# Altium schematic sheet TL203蓝牙主板20529.SchDoc
size A2; PageSetup: Record=PageOptions|CenterHorizontal=True|CenterVertical=True|PrintScale=0.52|XCorrection=1.00|YCorrection=1.00|PrintKind=0|BorderSize=5000000|LeftOffset=0|BottomOffset=0|Orientation=2|PaperLength=1000|PaperWidth=1000|Scale=100|PaperSource=7|PrintQuality=-4|MediaType=1|DitherType=10|PaperKind=A4|PrintScaleMode=1
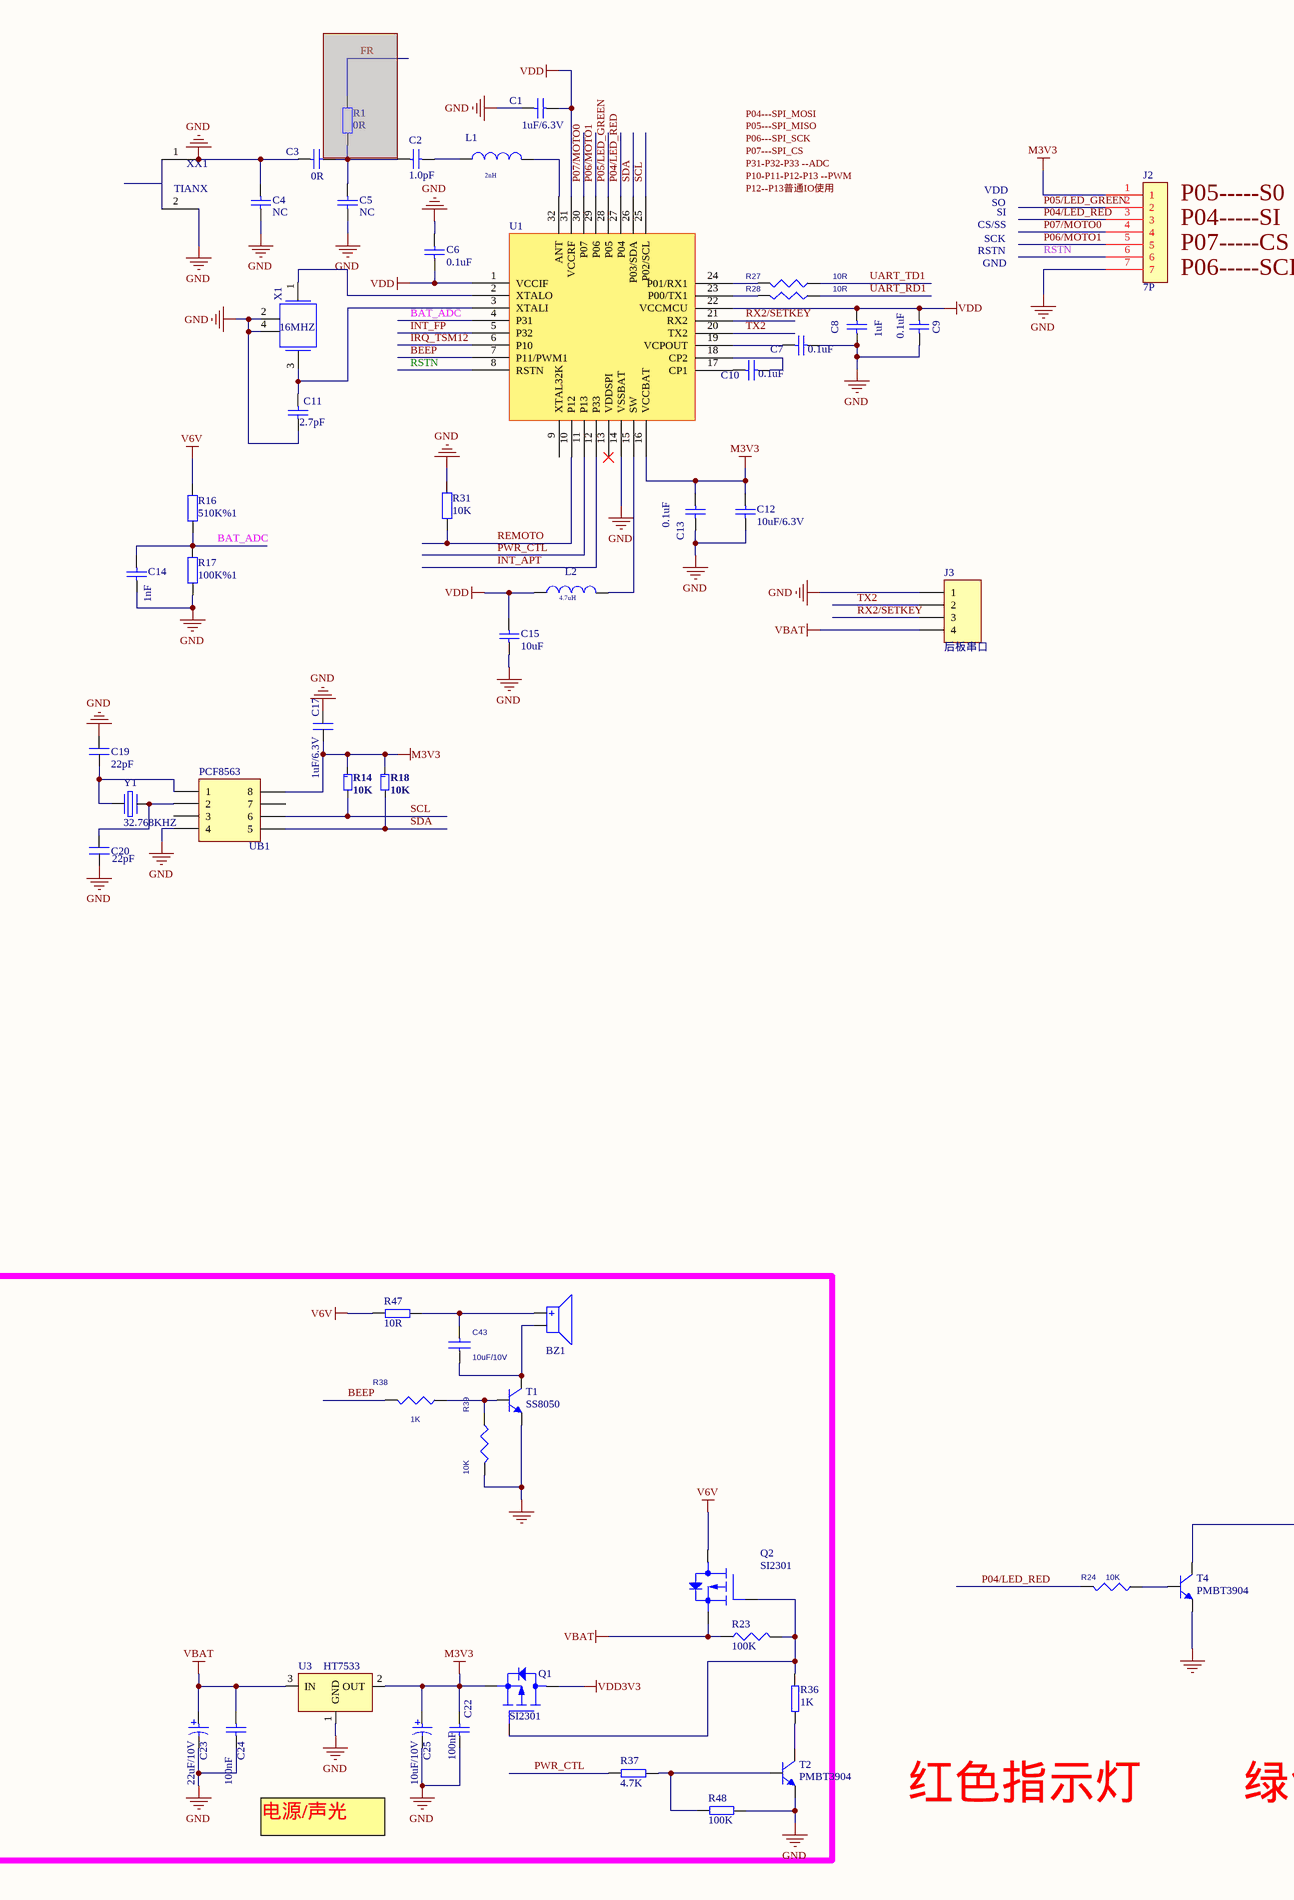
[diagram p0: TL203蓝牙主板20529.SchDoc, left]
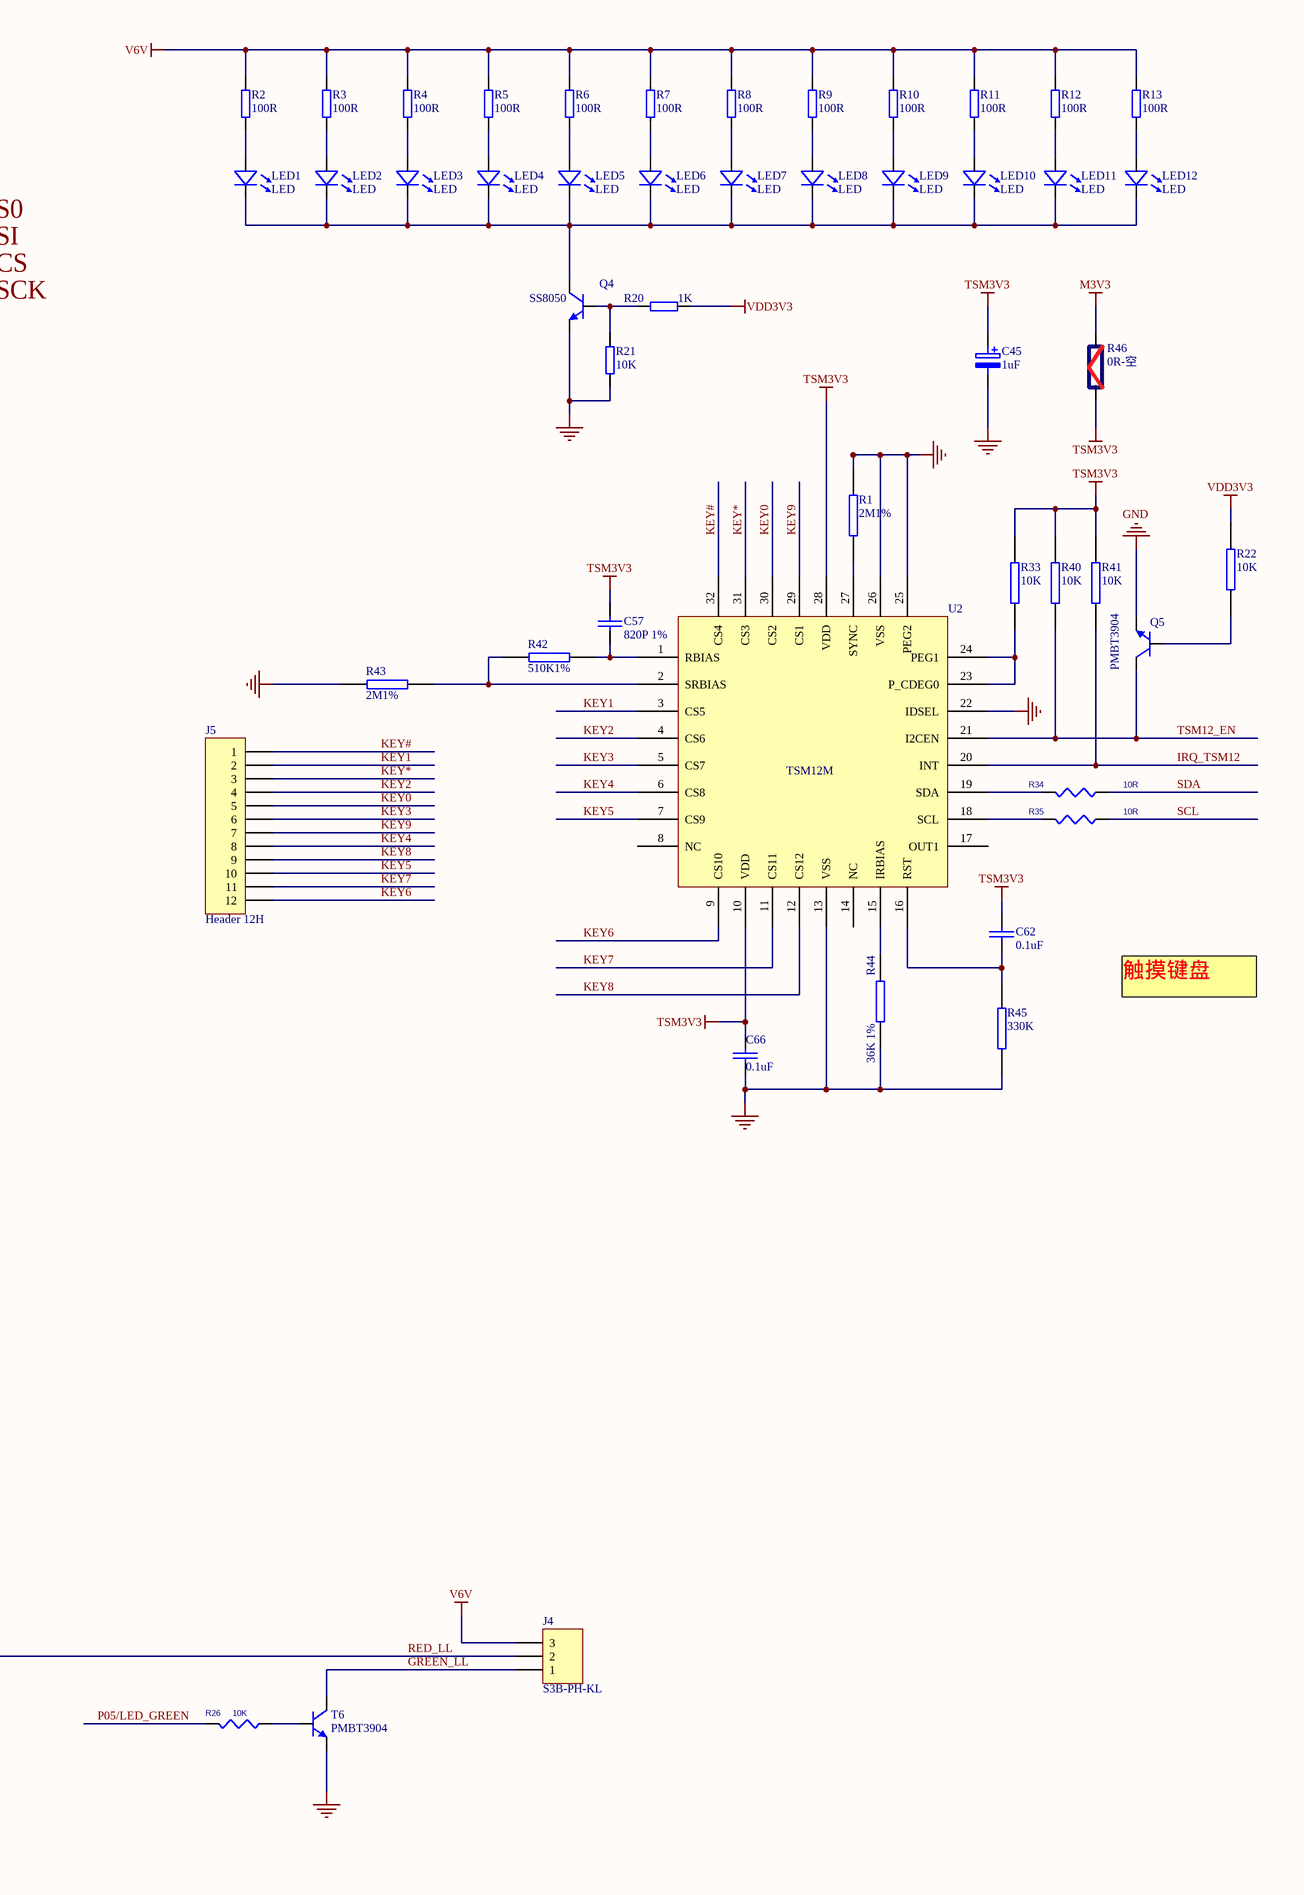
[diagram p1: TL203蓝牙主板20529.SchDoc, right]

## Parts
(Parts that share a designator on the sheet are numbered #1, #2 ... from top to bottom, then left to right.)
BZ1  BUZZER  [BUZZER_D93_L40]  (value not drawn)
C1  1uF/6.3V  [LC-0402_C]
C2  1.0pF  [LC-0402_C]
C3  0R  [LC-0402_C]
C4  NC  [LC-0402_C]
C5  NC  [LC-0402_C]
C6  0.1uF  [LC-0402_C]
C7  0.1uF  [LC-0402_C]
C8  1uF  [LC-0402_C]
C9  0.1uF  [LC-0402_C]
C10  0.1uF  [LC-0402_C]
C11  2.7pF  [LC-0402_C]
C12  10uF/6.3V  [LC-0603_C]
C13  0.1uF  [LC-0402_C]
C14  1nF  [LC-0402_C]
C15  10uF  [LC-0402_C]
C17  1uF/6.3V  [LC-0603_C]
C19  22pF  [LC-0603_C]
C20  22pF  [LC-0603_C]
C22  100nF  [LC-0603_C]
C23  22uF/10V  [LC-0805_C]
C24  100nF  [LC-0603_C]
C25  10uF/10V  [LC-0805_C]
C43  10uF/10V  [LC-0603_C]
C45  1uF  [LC-0603_C]
C57  820P 1%  [LC-0402_C]
C62  0.1uF  [LC-0402_C]
C66  0.1uF  [LC-0402_C]
J2  7P  [7P-2.0MM]
J3  后板串口  [4P-2.0XX]
J4  S3B-PH-KL  [3P-1.25mm-SMT]
J5  Header 12H  [6P*2*1.27MM_1]
L1  2nH  [LC-0402_L]
L2  4.7uH  [LC-0603_L]
LED1  LED  [0603LED]
LED2  LED  [0603LED]
LED3  LED  [0603LED]
LED4  LED  [0603LED]
LED5  LED  [0603LED]
LED6  LED  [0603LED]
LED7  LED  [0603LED]
LED8  LED  [0603LED]
LED9  LED  [0603LED]
LED10  LED  [0603LED]
LED11  LED  [0603LED]
LED12  LED  [0603LED]
Q1  SI2301  [SOT-23 - GDS]
Q2  SI2301  [SOT-23 - GDS]
Q4  SS8050  [SOT-23-3L]
Q5  PMBT3904  [SOT-23-3L]
R1#1  0R  [LC-0603_R]  (masked out: inside a compile mask, not in the netlist)
R1#2  2M1%  [LC-0402_R]
R2  100R  [LC-0603_R]
R3  100R  [LC-0603_R]
R4  100R  [LC-0603_R]
R5  100R  [LC-0603_R]
R6  100R  [LC-0603_R]
R7  100R  [LC-0603_R]
R8  100R  [LC-0603_R]
R9  100R  [LC-0603_R]
R10  100R  [LC-0603_R]
R11  100R  [LC-0603_R]
R12  100R  [LC-0603_R]
R13  100R  [LC-0603_R]
R14  10K  [LC-0603_R]
R16  510K%1  [LC-0402_R]
R17  100K%1  [LC-0402_R]
R18  10K  [LC-0603_R]
R20  1K  [LC-0603_R]
R21  10K  [LC-0603_R]
R22  10K  [LC-0603_R]
R23  100K  [LC-0603_R]
R24  10K  [LC-0603_R]
R26  10K  [LC-0603_R]
R27  10R  [LC-0402_R]
R28  10R  [LC-0402_R]
R31  10K  [LC-0402_R]
R33  10K  [LC-0402_R]
R34  10R  [LC-0402_R]
R35  10R  [LC-0402_R]
R36  1K  [LC-0603_R]
R37  4.7K  [LC-0603_R]
R38  1K  [LC-0603_R]
R39  10K  [LC-0603_R]
R40  10K  [LC-0402_R]
R41  10K  [LC-0402_R]
R42  510K1%  [LC-0402_R]
R43  2M1%  [LC-0402_R]
R44  36K 1%  [LC-0402_R]
R45  330K  [LC-0402_R]
R46  0R-空  [LC-0603_R]
R47  10R  [LC-0603_R]
R48  100K  [LC-0603_R]
T1  SS8050  [SOT-23-3L]
T2  PMBT3904  [SOT-23-3L]
T4  PMBT3904  [SOT-23-3L]
T6  PMBT3904  [SOT-23-3L]
U1  BK3431Q  [QFN32_4*4*0.4]  (value not drawn)
U2  TSM12M  [ADS_TMS12]
U3  HT7533  [SOT-23-3L]
UB1  PCF8563  [SOP8]
X1  16MHZ  [XTAL3225]
XX1  TIANX  [BT_NAMI_1]
Y1  32.768KHZ  [晶振-9]

## Nets
GND: C1.1 C3.1 C4.1 C4.2 C5.1 C6.1 C7.2 C8.1 C9.1 C11.1 C12.2 C13.2 C14.1 C15.1 C17.2 C19.2 C20.1 C22.2 C23.2 C24.2 C25.2 C45.2 C66.1 J2.7 J3.1 Q4.2 Q5.2 R1#2.2 R17.2 R21.1 R31.1 R39.2 R43.1 R44.1 R45.1 R48.1 T1.2 T2.2 T4.2 T6.2 U1.14(VSSBAT) U2.13(VSS) U2.22(IDSEL) U2.25(PEG2) U2.26(VSS) U3.1(GND) UB1.4 X1.2 X1.4 XX1.1 XX1.2
M3V3: C12.1 C13.1 C17.1 C22.1 C25.1 J2.1 Q1.S(SOURCE) R14.1 R18.1 R46.2 U1.16(VCCBAT) U3.2(OUT) UB1.8
TSM3V3: C45.1 C57.2 C62.2 C66.2 R33.2 R40.2 R41.2 R46.1 U2.10(VDD) U2.28(VDD)
V6V: J4.3 Q2.D(DRAIN) R2.2 R3.2 R4.2 R5.2 R6.2 R7.2 R8.2 R9.2 R10.2 R11.2 R12.2 R13.2 R16.1 R47.2
VBAT: C23.1 C24.1 J3.4 Q2.S(SOURCE) R23.1 U3.3(IN)
VDD: C1.2 C6.2 C8.2 C9.2 C15.2 L2.1(P1) U1.1(VCCIF) U1.22(VCCMCU) U1.31(VCCRF)
VDD3V3: Q1.D(DRAIN) R20.2 R22.2
BAT_ADC: C14.2 R16.2 R17.1 U1.4(P31)
BEEP: R38.2 U1.7(P11/PWM1)
GREEN_LL: J4.1 T6.3
INT_APT: U1.12(P33)
INT_FP: U1.5(P32)
IRQ_TSM12: R41.1 U1.6(P10) U2.20(INT)
KEY0: J5.5 U2.30(CS2)
KEY1: J5.2 U2.3(CS5)
KEY2: J5.4 U2.4(CS6)
KEY3: J5.6 U2.5(CS7)
KEY4: J5.8 U2.6(CS8)
KEY5: J5.10 U2.7(CS9)
KEY6: J5.12 U2.9(CS10)
KEY7: J5.11 U2.11(CS11)
KEY8: J5.9 U2.12(CS12)
KEY9: J5.7 U2.29(CS1)
KEY#: J5.1 U2.32(CS4)
KEY*: J5.3 U2.31(CS3)
P04/LED_RED: J2.3 R24.2 U1.27(P04)
P05/LED_GREEN: J2.2 R26.2 U1.28(P05)
P06/MOTO1: J2.5 U1.29(P06)
P07/MOTO0: J2.4 U1.30(P07)
PWR_CTL: R37.1 U1.11(P13)
RED_LL: J4.2 T4.3
REMOTO: R31.2 U1.10(P12)
RSTN: J2.6 U1.8(RSTN)
RX2/SETKEY: J3.3 U1.21(RX2)
SCL: R14.2 R35.1 U1.25(P02/SCL) UB1.6
SDA: R18.2 R34.1 U1.26(P03/SDA) UB1.5
TSM12_EN: Q5.3 R40.1 U2.21(I2CEN)
TX2: J3.2 U1.20(TX2)
UART_RD1: R28.1
UART_TD1: R27.1
NetBZ1_1: BZ1.1 C43.2 R47.1
NetBZ1_2: BZ1.2 C43.1 T1.3
NetC2_1: C2.1 L1.1(P1)
NetC2_2: C2.2 C3.2 C5.2
NetC7_1: C7.1 U1.19(VCPOUT)
NetC10_1: C10.1 U1.17(CP1)
NetC10_2: C10.2 U1.18(CP2)
NetC11_2: C11.2 U1.3(XTALI) X1.3
NetC19_1: C19.1 UB1.1 Y1.1
NetC20_2: C20.2 UB1.2 Y1.2
NetC57_1: C57.1 R42.2 U2.1(RBIAS)
NetC62_1: C62.1 R45.2 U2.16(RST)
NetL1_2: L1.2(P2) U1.32(ANT)
NetL2_2: L2.2(P2) U1.15(SW)
NetLED1_1: LED1.1(a) R2.1
NetLED1_2: LED1.2(k) LED2.2(k) LED3.2(k) LED4.2(k) LED5.2(k) LED6.2(k) LED7.2(k) LED8.2(k) LED9.2(k) LED10.2(k) LED11.2(k) LED12.2(k) Q4.3
NetLED2_1: LED2.1(a) R3.1
NetLED3_1: LED3.1(a) R4.1
NetLED4_1: LED4.1(a) R5.1
NetLED5_1: LED5.1(a) R6.1
NetLED6_1: LED6.1(a) R7.1
NetLED7_1: LED7.1(a) R8.1
NetLED8_1: LED8.1(a) R9.1
NetLED9_1: LED9.1(a) R10.1
NetLED10_1: LED10.1(a) R11.1
NetLED11_1: LED11.1(a) R12.1
NetLED12_1: LED12.1(a) R13.1
NetQ1_G: Q1.G(GATE) Q2.G(GATE) R23.2 R36.1
NetQ4_1: Q4.1 R20.1 R21.2
NetQ5_1: Q5.1 R22.1
NetR1#2_1: R1#2.1 U2.27(SYNC)
NetR24_1: R24.1 T4.1
NetR26_1: R26.1 T6.1
NetR27_2: R27.2 U1.24(P01/RX1)
NetR28_2: R28.2 U1.23(P00/TX1)
NetR33_1: R33.1 U2.23(P_CDEG0) U2.24(PEG1)
NetR34_2: R34.2 U2.19(SDA)
NetR35_2: R35.2 U2.18(SCL)
NetR36_2: R36.2 T2.3
NetR37_2: R37.2 R48.2 T2.1
NetR38_1: R38.1 R39.1 T1.1
NetR42_1: R42.1 R43.2 U2.2(SRBIAS)
NetR44_2: R44.2 U2.15(IRBIAS)
NetU1_2: U1.2(XTALO) X1.1

Not connected (* = marked no-connect by the designer): U1 9(XTAL32K) 13(VDDSPI)*; U2 8(NC) 14(NC) 17(OUT1); UB1 3 7

## Notes on the sheet
- P04---SPI_MOSI
- P05---SPI_MISO
- P06---SPI_SCK
- P07---SPI_CS
- P31-P32-P33 --ADC
- P10-P11-P12-P13 --PWM
- P12--P13普通IO使用
- VDD
- RSTN
- CS/SS
- SCK
- SO
- SI
- (near J2) P04-----SI
- (near J2) P05-----S0
- (near J2) P07-----CS
- GND
- (near J2) P06-----SCK
- 触摸键盘
- 红色指示灯
- 绿色指示灯
- 电源/声光

## Library data of the parts
C1-C13 C15 = Cap: Capacitor; Value: 10pF; Published: 8-Jun-2000; LatestRevisionDate: 17-Jul-2002; LatestRevisionNote: Re-released for DXP Platform.; PackageReference: RAD-0.3; Publisher: Altium Limited; PackageDescription: Radial Cap, Thru-Hole; 2 Leads; 0.3 in Pin Spacing
C14 C22 C24 = CAP-NP: Capacitor, Ceramic; Capacitance: 18 pF; Dielectric: COG; Polarity: Non-Polarized; Rated Voltage: 50 mV; Tolerance: 5 %; Category: Capacitor; Mounting Technology: Surface Mount; Status: Unreleased; Technology: Ceramic
C17 C19 C20 = C
C23 C25 = CAP-P: Capacitor, tolerance ±20%
C43 = C_0_Dup1
C45 = C-C?: Electrolytic Capacitor
C57 C62 C66 = CAP: Capacitor
J3 = Header 4H: Header, 4-Pin, Right Angle; LatestRevisionDate: 17-Jul-2002; LatestRevisionNote: Re-released for DXP Platform.; Publisher: Altium Limited
J4 = Header 3: Header, 3-Pin; LatestRevisionDate: 17-Jul-2002; LatestRevisionNote: Re-released for DXP Platform.; Publisher: Altium Limited
J5 = Header 12H: Header, 12-Pin, Right Angle; LatestRevisionDate: 17-Jul-2002; LatestRevisionNote: Re-released for DXP Platform.; Publisher: Altium Limited
L1 L2 = INDUCTOR: Power Inductor, 4.7uH, 0.7A, 260mR DCR; XMOS Part Number: E-09-0011; Manufacturer: Taiyo Yuden; Manufacturer Part Number: CBC2518T4R7M; Part Creator: JG; LEVEL: STD; DEVICE: L; FORWARD_PCB: 1; Tolerance (%): 20; Max DC Resistance: 0.26R; Rated Current (Saturation): 0.68A; Rated Current (Temp Rise): 0.92A; Approx Volume Cost ($): 0.07; Approved: NO; VALUE: 2.0nH; Datasheet: http://www.yuden.co.jp/us/product/pdf/ecb2_e.pdf; Max Height (mm): 2; Digikey Link: http://search.digikey.com/scripts/DkSearch/dksus.dll?lang=en&site=US&keywords=CBC2518T4R7M
Q1 Q2 = PWRMOSFET_EP_DGS_0
Q4 Q5 T1 T2 T4 T6 = NPN_BJT: Bipolar Junction Transistor
R1#1 R16 R17 R31 = Res2: Resistor; Value: 470K; Published: 2013年12月24日; LatestRevisionDate: 2013年12月24日; LatestRevisionNote: Re-released for DXP Platform.
R1#2 R22 R33 R40-R45 = RES2
R2-R13 R20 R21 R23 R36 R37 R47 R48 = R
R14 R18 = RES_0603A: Resistor
R24 R26 = RES
R27 R28 R34 R35 R38 R39 = R_Dup1
R46 = POWER-R
U3 = XC6206P302M
UB1 = IC8
X1 = OSC: XMOS Part Number: E-07-0030; Manufacturer: Abracon; Manufacturer Part Number: ABLS-24.000MHz-B4; Part Creator: JG; LEVEL: STD; DEVICE: X; FORWARD_PCB: 1; Approx Volume Cost ($): 0.15; Approved: NO; VALUE: ABLS; FREQUENCY: 38.4MHZ; Datasheet: http://www.abracon.com/Resonators/abls.pdf; Max Height (mm): 4.2; Supplier Link: http://search.digikey.com/scripts/DkSearch/dksus.dll?lang=en&site=US&keywords=ABLS-24.000MHz-B4
Y1 = 晶振